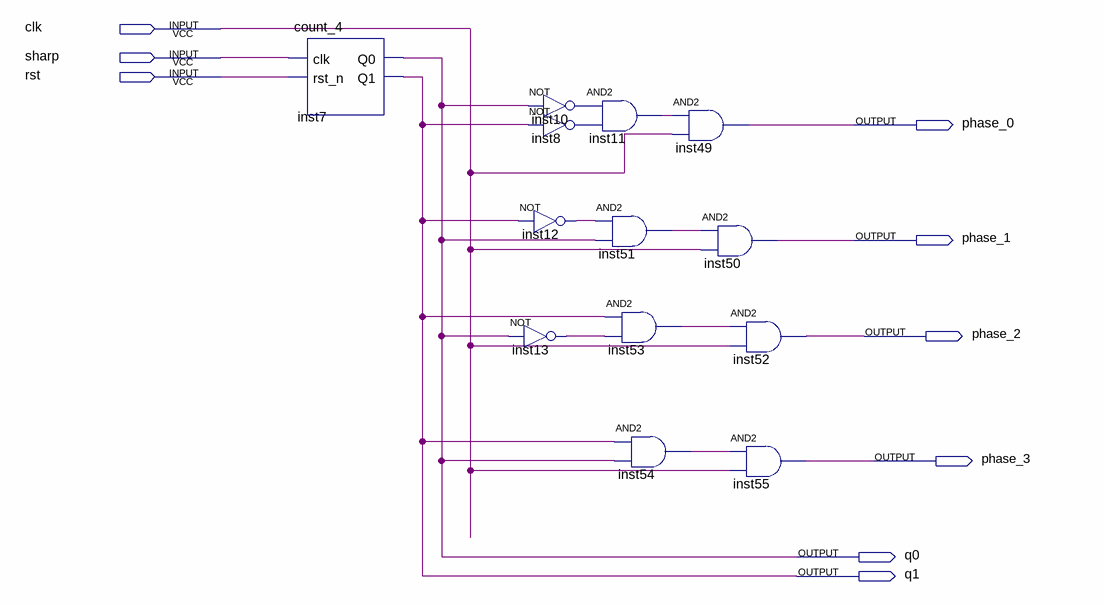
[diagram p0: schematic sheet]
// Quartus schematic phase_selector.bdf as structural Verilog: 13 symbols, 9 pins
module phase_selector (
  input  clk,
  input  sharp,
  input  rst,
  output phase_0,
  output phase_1,
  output phase_2,
  output phase_3,
  output q0,
  output q1
);

  wire inst8_out, inst10_out, inst11_out, inst12_out, inst13_out, inst51_out, inst53_out, inst54_out;

  count_4 inst7 (.clk(sharp), .rst_n(rst), .Q0(q0), .Q1(q1));
  not inst10 (inst10_out, q0);
  not inst8 (inst8_out, q1);
  not inst12 (inst12_out, q1);
  not inst13 (inst13_out, q0);
  and inst11 (inst11_out, inst10_out, inst8_out);
  and inst51 (inst51_out, inst12_out, q0);
  and inst53 (inst53_out, q1, inst13_out);
  and inst54 (inst54_out, q1, q0);
  and inst49 (phase_0, inst11_out, clk);
  and inst50 (phase_1, inst51_out, clk);
  and inst52 (phase_2, inst53_out, clk);
  and inst55 (phase_3, inst54_out, clk);
endmodule
